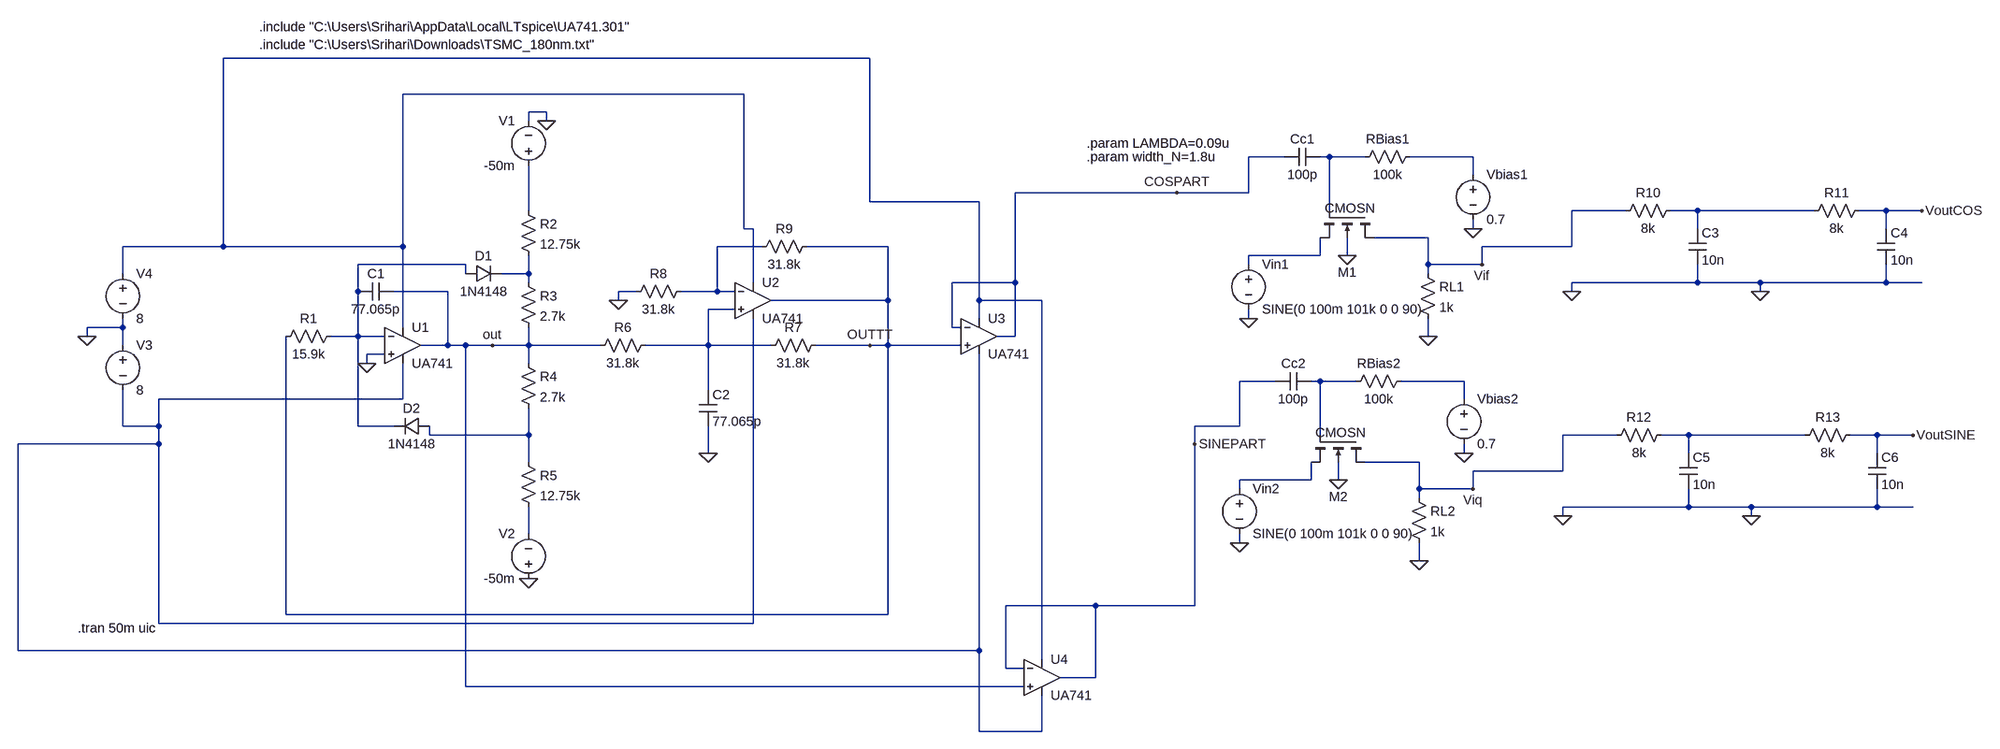
[diagram p0: schematic Circuit4.asc]
Circuit4.asc, the LTspice schematic file:
Version 4
SHEET 1 3176 680
WIRE 1168 -624 16 -624
WIRE 944 -560 336 -560
WIRE 592 -528 560 -528
WIRE 560 -512 560 -528
WIRE 592 -512 592 -528
WIRE 1920 -448 1856 -448
WIRE 2000 -448 1984 -448
WIRE 2064 -448 2000 -448
WIRE 2256 -448 2144 -448
WIRE 2256 -416 2256 -448
WIRE 1728 -384 1440 -384
WIRE 1856 -384 1856 -448
WIRE 1856 -384 1728 -384
WIRE 1168 -368 1168 -624
WIRE 1376 -368 1168 -368
WIRE 560 -352 560 -432
WIRE 2000 -352 2000 -448
WIRE 2528 -352 2432 -352
WIRE 2656 -352 2608 -352
WIRE 2864 -352 2656 -352
WIRE 2992 -352 2944 -352
WIRE 3056 -352 2992 -352
WIRE 944 -320 944 -560
WIRE 960 -320 944 -320
WIRE 2256 -320 2256 -336
WIRE 2656 -320 2656 -352
WIRE 2992 -320 2992 -352
WIRE 2176 -304 2080 -304
WIRE 16 -288 16 -624
WIRE 16 -288 -176 -288
WIRE 336 -288 336 -560
WIRE 336 -288 16 -288
WIRE 976 -288 896 -288
WIRE 1200 -288 1056 -288
WIRE 2432 -288 2432 -352
WIRE 2432 -288 2272 -288
WIRE 1984 -272 1984 -304
WIRE 1984 -272 1856 -272
WIRE 2032 -272 2032 -304
WIRE 448 -256 256 -256
WIRE 1856 -256 1856 -272
WIRE 2176 -256 2176 -304
WIRE 2272 -256 2272 -288
WIRE 2272 -256 2176 -256
WIRE -176 -240 -176 -288
WIRE 448 -240 448 -256
WIRE 560 -240 560 -272
WIRE 560 -240 512 -240
WIRE 2176 -240 2176 -256
WIRE 560 -224 560 -240
WIRE 960 -224 960 -320
WIRE 1440 -224 1440 -384
WIRE 1440 -224 1328 -224
WIRE 2656 -224 2656 -256
WIRE 2656 -224 2432 -224
WIRE 2768 -224 2656 -224
WIRE 2992 -224 2992 -256
WIRE 2992 -224 2768 -224
WIRE 3056 -224 2992 -224
WIRE 256 -208 256 -256
WIRE 416 -208 320 -208
WIRE 752 -208 720 -208
WIRE 896 -208 896 -288
WIRE 896 -208 832 -208
WIRE 928 -208 896 -208
WIRE 2432 -208 2432 -224
WIRE 2768 -208 2768 -224
WIRE 720 -192 720 -208
WIRE 1200 -192 1200 -288
WIRE 1200 -192 992 -192
WIRE 1376 -192 1376 -368
WIRE 1488 -192 1376 -192
WIRE 928 -176 880 -176
WIRE 1376 -160 1376 -192
WIRE 1856 -160 1856 -176
WIRE -176 -144 -176 -160
WIRE -176 -144 -240 -144
WIRE 336 -144 336 -288
WIRE 1328 -144 1328 -224
WIRE 1344 -144 1328 -144
WIRE -240 -128 -240 -144
WIRE 256 -128 256 -208
WIRE 256 -128 208 -128
WIRE 304 -128 256 -128
WIRE 1440 -128 1440 -224
WIRE 1440 -128 1408 -128
WIRE 2176 -128 2176 -160
WIRE -176 -112 -176 -144
WIRE 416 -112 416 -208
WIRE 416 -112 368 -112
WIRE 448 -112 416 -112
WIRE 496 -112 448 -112
WIRE 560 -112 560 -144
WIRE 560 -112 496 -112
WIRE 688 -112 560 -112
WIRE 880 -112 880 -176
WIRE 880 -112 768 -112
WIRE 992 -112 880 -112
WIRE 1168 -112 1072 -112
WIRE 1200 -112 1200 -192
WIRE 1200 -112 1168 -112
WIRE 1344 -112 1200 -112
WIRE 304 -96 272 -96
WIRE 272 -80 272 -96
WIRE 560 -80 560 -112
WIRE 1904 -48 1840 -48
WIRE 1984 -48 1968 -48
WIRE 2048 -48 1984 -48
WIRE 2240 -48 2128 -48
WIRE 880 -32 880 -112
WIRE 336 -16 336 -80
WIRE 336 -16 -112 -16
WIRE 2240 -16 2240 -48
WIRE -176 32 -176 -32
WIRE -112 32 -112 -16
WIRE -112 32 -176 32
WIRE 256 32 256 -128
WIRE 320 32 256 32
WIRE 1840 32 1840 -48
WIRE 1840 32 1760 32
WIRE 384 48 384 32
WIRE 560 48 560 0
WIRE 560 48 384 48
WIRE 1984 48 1984 -48
WIRE 2512 48 2416 48
WIRE 2640 48 2592 48
WIRE 2848 48 2640 48
WIRE 2976 48 2928 48
WIRE 3040 48 2976 48
WIRE -112 64 -112 32
WIRE -112 64 -448 64
WIRE 1760 64 1760 32
WIRE 880 80 880 32
WIRE 2240 80 2240 64
WIRE 2640 80 2640 48
WIRE 2976 80 2976 48
WIRE 560 96 560 48
WIRE 2160 96 2064 96
WIRE 2416 112 2416 48
WIRE 2416 112 2256 112
WIRE 1968 128 1968 96
WIRE 1968 128 1840 128
WIRE 2016 128 2016 96
WIRE 1840 144 1840 128
WIRE 2160 144 2160 96
WIRE 2256 144 2256 112
WIRE 2256 144 2160 144
WIRE 2160 160 2160 144
WIRE 2640 176 2640 144
WIRE 2640 176 2416 176
WIRE 2752 176 2640 176
WIRE 2976 176 2976 144
WIRE 2976 176 2752 176
WIRE 3040 176 2976 176
WIRE 2416 192 2416 176
WIRE 2752 192 2752 176
WIRE 560 224 560 176
WIRE 1840 240 1840 224
WIRE 2160 272 2160 240
WIRE 1584 352 1424 352
WIRE 1760 352 1760 64
WIRE 1760 352 1584 352
WIRE 128 368 128 -128
WIRE 1200 368 1200 -112
WIRE 1200 368 128 368
WIRE -112 384 -112 64
WIRE 960 384 960 -160
WIRE 960 384 -112 384
WIRE -448 432 -448 64
WIRE 1376 432 1376 -96
WIRE 1376 432 -448 432
WIRE 1488 448 1488 -192
WIRE 1424 464 1424 352
WIRE 1456 464 1424 464
WIRE 1584 480 1584 352
WIRE 1584 480 1520 480
WIRE 448 496 448 -112
WIRE 1456 496 448 496
WIRE 1376 576 1376 432
WIRE 1488 576 1488 512
WIRE 1488 576 1376 576
FLAG 272 -80 0
FLAG 592 -512 0
FLAG 496 -112 out
FLAG 560 304 0
FLAG 880 80 0
FLAG 720 -192 0
FLAG -240 -128 0
FLAG 1168 -112 OUTTT
FLAG 2256 -320 0
FLAG 2032 -272 0
FLAG 1856 -160 0
FLAG 2176 -128 0
FLAG 2272 -256 Vif
FLAG 2432 -208 0
FLAG 2768 -208 0
FLAG 3056 -352 VoutCOS
FLAG 1728 -384 COSPART
FLAG 2240 80 0
FLAG 2016 128 0
FLAG 1840 240 0
FLAG 2160 272 0
FLAG 2256 144 Viq
FLAG 2416 192 0
FLAG 2752 192 0
FLAG 3040 48 VoutSINE
FLAG 1760 64 SINEPART
SYMBOL OpAmps\\opamp2 336 -176 R0
SYMATTR InstName U1
SYMATTR Value UA741
SYMBOL res 224 -144 R90
WINDOW 0 0 56 VBottom 2
WINDOW 3 32 56 VTop 2
SYMATTR InstName R1
SYMATTR Value 15.9k
SYMBOL cap 320 -224 R90
WINDOW 0 0 32 VBottom 2
WINDOW 3 32 32 VTop 2
SYMATTR InstName C1
SYMATTR Value 77.065p
SYMBOL diode 448 -224 R270
WINDOW 0 32 32 VTop 2
WINDOW 3 0 32 VBottom 2
SYMATTR InstName D1
SYMATTR Value 1N4148
SYMBOL res 544 -368 R0
SYMATTR InstName R2
SYMATTR Value 12.75k
SYMBOL voltage 560 -416 R180
WINDOW 0 24 96 Left 2
WINDOW 3 24 16 Left 2
WINDOW 123 0 0 Left 0
WINDOW 39 0 0 Left 0
SYMATTR InstName V1
SYMATTR Value -50m
SYMBOL res 544 -240 R0
SYMATTR InstName R3
SYMATTR Value 2.7k
SYMBOL res 544 -96 R0
SYMATTR InstName R4
SYMATTR Value 2.7k
SYMBOL diode 384 16 R90
WINDOW 0 0 32 VBottom 2
WINDOW 3 32 32 VTop 2
SYMATTR InstName D2
SYMATTR Value 1N4148
SYMBOL voltage 560 320 R180
WINDOW 0 24 96 Left 2
WINDOW 3 24 16 Left 2
WINDOW 123 0 0 Left 0
WINDOW 39 0 0 Left 0
SYMATTR InstName V2
SYMATTR Value -50m
SYMBOL res 544 80 R0
SYMATTR InstName R5
SYMATTR Value 12.75k
SYMBOL res 784 -128 R90
WINDOW 0 0 56 VBottom 2
WINDOW 3 32 56 VTop 2
SYMATTR InstName R6
SYMATTR Value 31.8k
SYMBOL cap 864 -32 R0
SYMATTR InstName C2
SYMATTR Value 77.065p
SYMBOL OpAmps\\opamp2 960 -256 R0
SYMATTR InstName U2
SYMATTR Value UA741
SYMBOL res 1088 -128 R90
WINDOW 0 0 56 VBottom 2
WINDOW 3 32 56 VTop 2
SYMATTR InstName R7
SYMATTR Value 31.8k
SYMBOL res 848 -224 R90
WINDOW 0 0 56 VBottom 2
WINDOW 3 32 56 VTop 2
SYMATTR InstName R8
SYMATTR Value 31.8k
SYMBOL res 1072 -304 R90
WINDOW 0 0 56 VBottom 2
WINDOW 3 32 56 VTop 2
SYMATTR InstName R9
SYMATTR Value 31.8k
SYMBOL voltage -176 -128 R0
SYMATTR InstName V3
SYMATTR Value 8
SYMBOL voltage -176 -256 R0
SYMATTR InstName V4
SYMATTR Value 8
SYMBOL OpAmps\\opamp2 1376 -192 R0
SYMATTR InstName U3
SYMATTR Value UA741
SYMBOL cap 1984 -464 R90
WINDOW 0 0 32 VBottom 2
WINDOW 3 32 32 VTop 2
SYMATTR InstName Cc1
SYMATTR Value 100p
SYMBOL res 2160 -464 R90
WINDOW 0 0 56 VBottom 2
WINDOW 3 32 56 VTop 2
SYMATTR InstName RBias1
SYMATTR Value 100k
SYMBOL voltage 2256 -432 R0
WINDOW 123 0 0 Left 0
WINDOW 39 0 0 Left 0
SYMATTR InstName Vbias1
SYMATTR Value 0.7
SYMBOL voltage 1856 -272 R0
WINDOW 123 0 0 Left 0
WINDOW 39 0 0 Left 0
SYMATTR InstName Vin1
SYMATTR Value SINE(0 100m 101k 0 0 90)
SYMBOL nmos4 2080 -352 R90
WINDOW 0 110 31 VRight 2
WINDOW 3 -4 -1 VRight 2
SYMATTR InstName M1
SYMATTR Value CMOSN
SYMATTR Value2 l={2*LAMBDA} w={width_N} ad={5*width_N*LAMBDA} as={5*width_N*LAMBDA} pd={10*LAMBDA + 2*width_N} ps={10*LAMBDA + 2*width_N} m=1
SYMBOL res 2160 -256 R0
SYMATTR InstName RL1
SYMATTR Value 1k
SYMBOL res 2624 -368 R90
WINDOW 0 0 56 VBottom 2
WINDOW 3 32 56 VTop 2
SYMATTR InstName R10
SYMATTR Value 8k
SYMBOL cap 2640 -320 R0
SYMATTR InstName C3
SYMATTR Value 10n
SYMBOL res 2960 -368 R90
WINDOW 0 0 56 VBottom 2
WINDOW 3 32 56 VTop 2
SYMATTR InstName R11
SYMATTR Value 8k
SYMBOL cap 2976 -320 R0
SYMATTR InstName C4
SYMATTR Value 10n
SYMBOL cap 1968 -64 R90
WINDOW 0 0 32 VBottom 2
WINDOW 3 32 32 VTop 2
SYMATTR InstName Cc2
SYMATTR Value 100p
SYMBOL res 2144 -64 R90
WINDOW 0 0 56 VBottom 2
WINDOW 3 32 56 VTop 2
SYMATTR InstName RBias2
SYMATTR Value 100k
SYMBOL voltage 2240 -32 R0
WINDOW 123 0 0 Left 0
WINDOW 39 0 0 Left 0
SYMATTR InstName Vbias2
SYMATTR Value 0.7
SYMBOL voltage 1840 128 R0
WINDOW 123 0 0 Left 0
WINDOW 39 0 0 Left 0
SYMATTR InstName Vin2
SYMATTR Value SINE(0 100m 101k 0 0 90)
SYMBOL nmos4 2064 48 R90
WINDOW 0 110 31 VRight 2
WINDOW 3 -4 -1 VRight 2
SYMATTR InstName M2
SYMATTR Value CMOSN
SYMATTR Value2 l={2*LAMBDA} w={width_N} ad={5*width_N*LAMBDA} as={5*width_N*LAMBDA} pd={10*LAMBDA + 2*width_N} ps={10*LAMBDA + 2*width_N} m=1
SYMBOL res 2144 144 R0
SYMATTR InstName RL2
SYMATTR Value 1k
SYMBOL res 2608 32 R90
WINDOW 0 0 56 VBottom 2
WINDOW 3 32 56 VTop 2
SYMATTR InstName R12
SYMATTR Value 8k
SYMBOL cap 2624 80 R0
SYMATTR InstName C5
SYMATTR Value 10n
SYMBOL res 2944 32 R90
WINDOW 0 0 56 VBottom 2
WINDOW 3 32 56 VTop 2
SYMATTR InstName R13
SYMATTR Value 8k
SYMBOL cap 2960 80 R0
SYMATTR InstName C6
SYMATTR Value 10n
SYMBOL OpAmps\\opamp2 1488 416 R0
SYMATTR InstName U4
SYMATTR Value UA741
TEXT 80 -680 Left 2 !.include "C:\\Users\\Srihari\\AppData\\Local\\LTspice\\UA741.301"
TEXT -256 392 Left 2 !.tran 50m uic
TEXT 1568 -472 Left 2 !.param LAMBDA=0.09u
TEXT 1568 -448 Left 2 !.param width_N=1.8u
TEXT 80 -648 Left 2 !.include "C:\\Users\\Srihari\\Downloads\\TSMC_180nm.txt"

The netlist it stands for:
* Circuit4.asc
XU1 0 N008 N001 N013 out UA741  ; pins In+ In- V+ V- OUT
R1 N008 OUTTT 15.9k
C1 out N008 77.065p
D1 N008 N009 1N4148
R2 N004 N009 12.75k
V1 N004 0 -50m
R3 N009 out 2.7k
R4 out N014 2.7k
D2 N014 N008 1N4148
V2 0 N017 -50m
R5 N014 N017 12.75k
R6 N010 out 31.8k
C2 N010 0 77.065p
XU2 N010 N006 N001 N013 OUTTT UA741  ; pins In+ In- V+ V- OUT
R7 OUTTT N010 31.8k
R8 N006 0 31.8k
R9 OUTTT N006 31.8k
V3 0 N013 8
V4 N001 0 8
XU3 OUTTT COSPART N001 N013 COSPART UA741  ; pins In+ In- V+ V- OUT
Cc1 N002 COSPART 100p
RBias1 N003 N002 100k
Vbias1 N003 0 0.7
Vin1 N007 0 SINE(0 100m 101k 0 0 90)
M1 Vif N002 N007 0 CMOSN l={2*LAMBDA} w={width_N} ad={5*width_N*LAMBDA} as={5*width_N*LAMBDA} pd={10*LAMBDA + 2*width_N} ps={10*LAMBDA + 2*width_N} m=1
RL1 Vif 0 1k
R10 N005 Vif 8k
C3 N005 0 10n
R11 VoutCOS N005 8k
C4 VoutCOS 0 10n
Cc2 N011 SINEPART 100p
RBias2 N012 N011 100k
Vbias2 N012 0 0.7
Vin2 N016 0 SINE(0 100m 101k 0 0 90)
M2 Viq N011 N016 0 CMOSN l={2*LAMBDA} w={width_N} ad={5*width_N*LAMBDA} as={5*width_N*LAMBDA} pd={10*LAMBDA + 2*width_N} ps={10*LAMBDA + 2*width_N} m=1
RL2 Viq 0 1k
R12 N015 Viq 8k
C5 N015 0 10n
R13 VoutSINE N015 8k
C6 VoutSINE 0 10n
XU4 out SINEPART N001 N013 SINEPART UA741  ; pins In+ In- V+ V- OUT
.model D D
.lib standard.dio
.model NMOS NMOS
.model PMOS PMOS
.lib standard.mos
.include "C:\Users\Srihari\AppData\Local\LTspice\UA741.301"
.tran 50m uic
.param LAMBDA=0.09u
.param width_N=1.8u
.include "C:\Users\Srihari\Downloads\TSMC_180nm.txt"
.backanno
.end